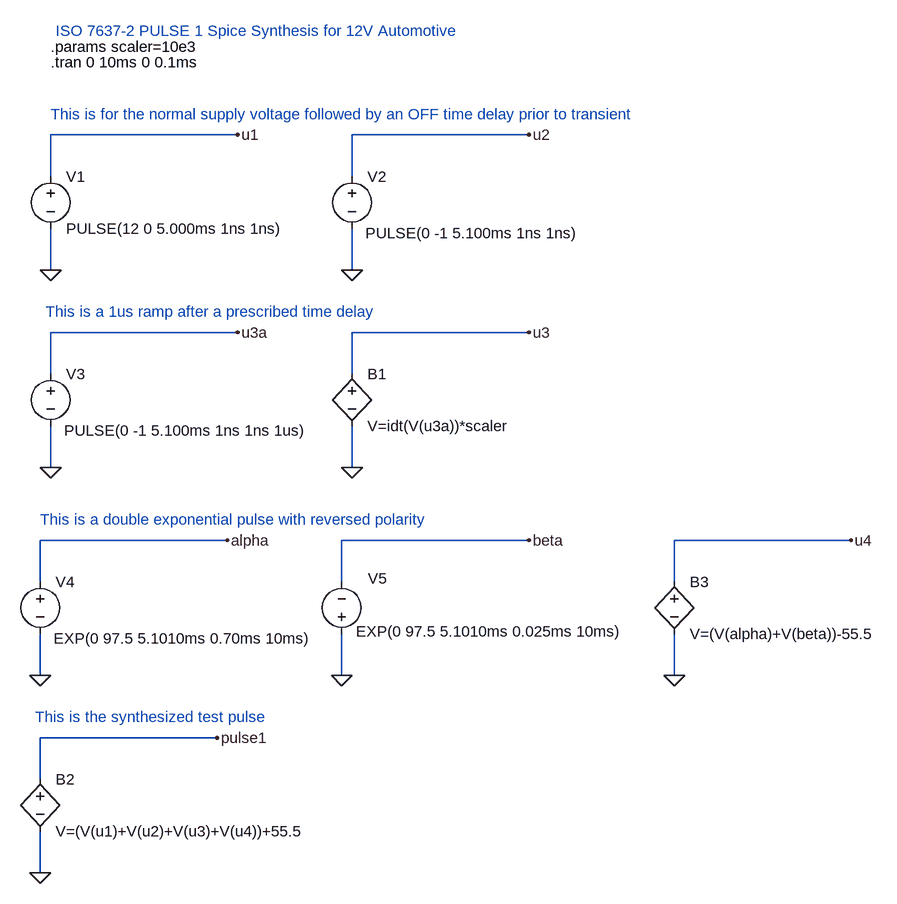
[diagram p0: schematic ISO 7632-1 PULSE 1 SPICE synthesis.asc]
ISO 7632-1 PULSE 1 SPICE synthesis.asc, the LTspice schematic file:
Version 4
SHEET 1 908 740
WIRE -1216 -576 -1504 -576
WIRE -768 -576 -1040 -576
WIRE -1504 -512 -1504 -576
WIRE -1040 -512 -1040 -576
WIRE -1504 -368 -1504 -432
WIRE -1040 -368 -1040 -432
WIRE -1216 -272 -1504 -272
WIRE -768 -272 -1040 -272
WIRE -1504 -208 -1504 -272
WIRE -1040 -208 -1040 -272
WIRE -1504 -64 -1504 -128
WIRE -1040 -64 -1040 -128
WIRE -1232 48 -1520 48
WIRE -768 48 -1056 48
WIRE -272 48 -544 48
WIRE -1520 112 -1520 48
WIRE -1056 112 -1056 48
WIRE -544 112 -544 48
WIRE -1520 256 -1520 192
WIRE -1056 256 -1056 192
WIRE -544 256 -544 192
WIRE -1248 352 -1520 352
WIRE -1520 416 -1520 352
WIRE -1520 560 -1520 496
FLAG -1216 -576 u1
FLAG -1040 -368 0
FLAG -1504 -368 0
FLAG -768 -576 u2
FLAG -1504 -64 0
FLAG -1216 -272 u3a
FLAG -1040 -64 0
FLAG -768 -272 u3
FLAG -1520 560 0
FLAG -1248 352 pulse1
FLAG -1520 256 0
FLAG -1232 48 alpha
FLAG -1056 256 0
FLAG -768 48 beta
FLAG -544 256 0
FLAG -272 48 u4
SYMBOL voltage -1504 -528 R0
WINDOW 123 0 0 Left 0
WINDOW 39 0 0 Left 0
SYMATTR InstName V1
SYMATTR Value PULSE(12 0 5.000ms 1ns 1ns)
SYMBOL voltage -1040 -528 R0
WINDOW 3 21 103 Left 0
WINDOW 123 0 0 Left 0
WINDOW 39 0 0 Left 0
SYMATTR Value PULSE(0 -1 5.100ms 1ns 1ns)
SYMATTR InstName V2
SYMBOL voltage -1504 -224 R0
WINDOW 3 21 103 Left 0
WINDOW 123 0 0 Left 0
WINDOW 39 0 0 Left 0
SYMATTR Value PULSE(0 -1 5.100ms 1ns 1ns 1us)
SYMATTR InstName V3
SYMBOL bv -1040 -224 R0
SYMATTR InstName B1
SYMATTR Value V=idt(V(u3a))*scaler
SYMBOL bv -1520 400 R0
SYMATTR InstName B2
SYMATTR Value V=(V(u1)+V(u2)+V(u3)+V(u4))+55.5
SYMBOL voltage -1520 96 R0
WINDOW 3 21 103 Left 0
WINDOW 123 0 0 Left 0
WINDOW 39 0 0 Left 0
SYMATTR Value EXP(0 97.5 5.1010ms 0.70ms 10ms)
SYMATTR InstName V4
SYMBOL voltage -1056 208 R180
WINDOW 3 -432 20 Left 0
WINDOW 123 0 0 Left 0
WINDOW 39 0 0 Left 0
WINDOW 0 -70 101 Left 0
SYMATTR Value EXP(0 97.5 5.1010ms 0.025ms 10ms)
SYMATTR InstName V5
SYMBOL bv -544 96 R0
SYMATTR InstName B3
SYMATTR Value V=(V(alpha)+V(beta))-55.5
TEXT -1504 -688 Left 0 !.tran 0 10ms 0 0.1ms
TEXT -1496 -736 Left 0 ;ISO 7637-2 PULSE 1 Spice Synthesis for 12V Automotive
TEXT -1504 -712 Left 0 !.params scaler=10e3
TEXT -1520 16 Left 0 ;This is a double exponential pulse with reversed polarity
TEXT -1504 -608 Left 0 ;This is for the normal supply voltage followed by an OFF time delay prior to transient
TEXT -1512 -304 Left 0 ;This is a 1us ramp after a prescribed time delay
TEXT -1528 320 Left 0 ;This is the synthesized test pulse

The netlist it stands for:
* ISO 7632-1 PULSE 1 SPICE synthesis.asc
V1 u1 0 PULSE(12 0 5.000ms 1ns 1ns)
V2 u2 0 PULSE(0 -1 5.100ms 1ns 1ns)
V3 u3a 0 PULSE(0 -1 5.100ms 1ns 1ns 1us)
B1 u3 0 V=idt(V(u3a))*scaler
B2 pulse1 0 V=(V(u1)+V(u2)+V(u3)+V(u4))+55.5
V4 alpha 0 EXP(0 97.5 5.1010ms 0.70ms 10ms)
V5 0 beta EXP(0 97.5 5.1010ms 0.025ms 10ms)
B3 u4 0 V=(V(alpha)+V(beta))-55.5
.tran 0 10ms 0 0.1ms
* ISO 7637-2 PULSE 1 Spice Synthesis for 12V Automotive
.params scaler=10e3
* This is a double exponential pulse with reversed polarity
* This is for the normal supply voltage followed by an OFF time delay prior to transient
* This is a 1us ramp after a prescribed time delay
* This is the synthesized test pulse
.backanno
.end